# EAGLE schematic kicker-v2.2 (EAGLE 6.4)
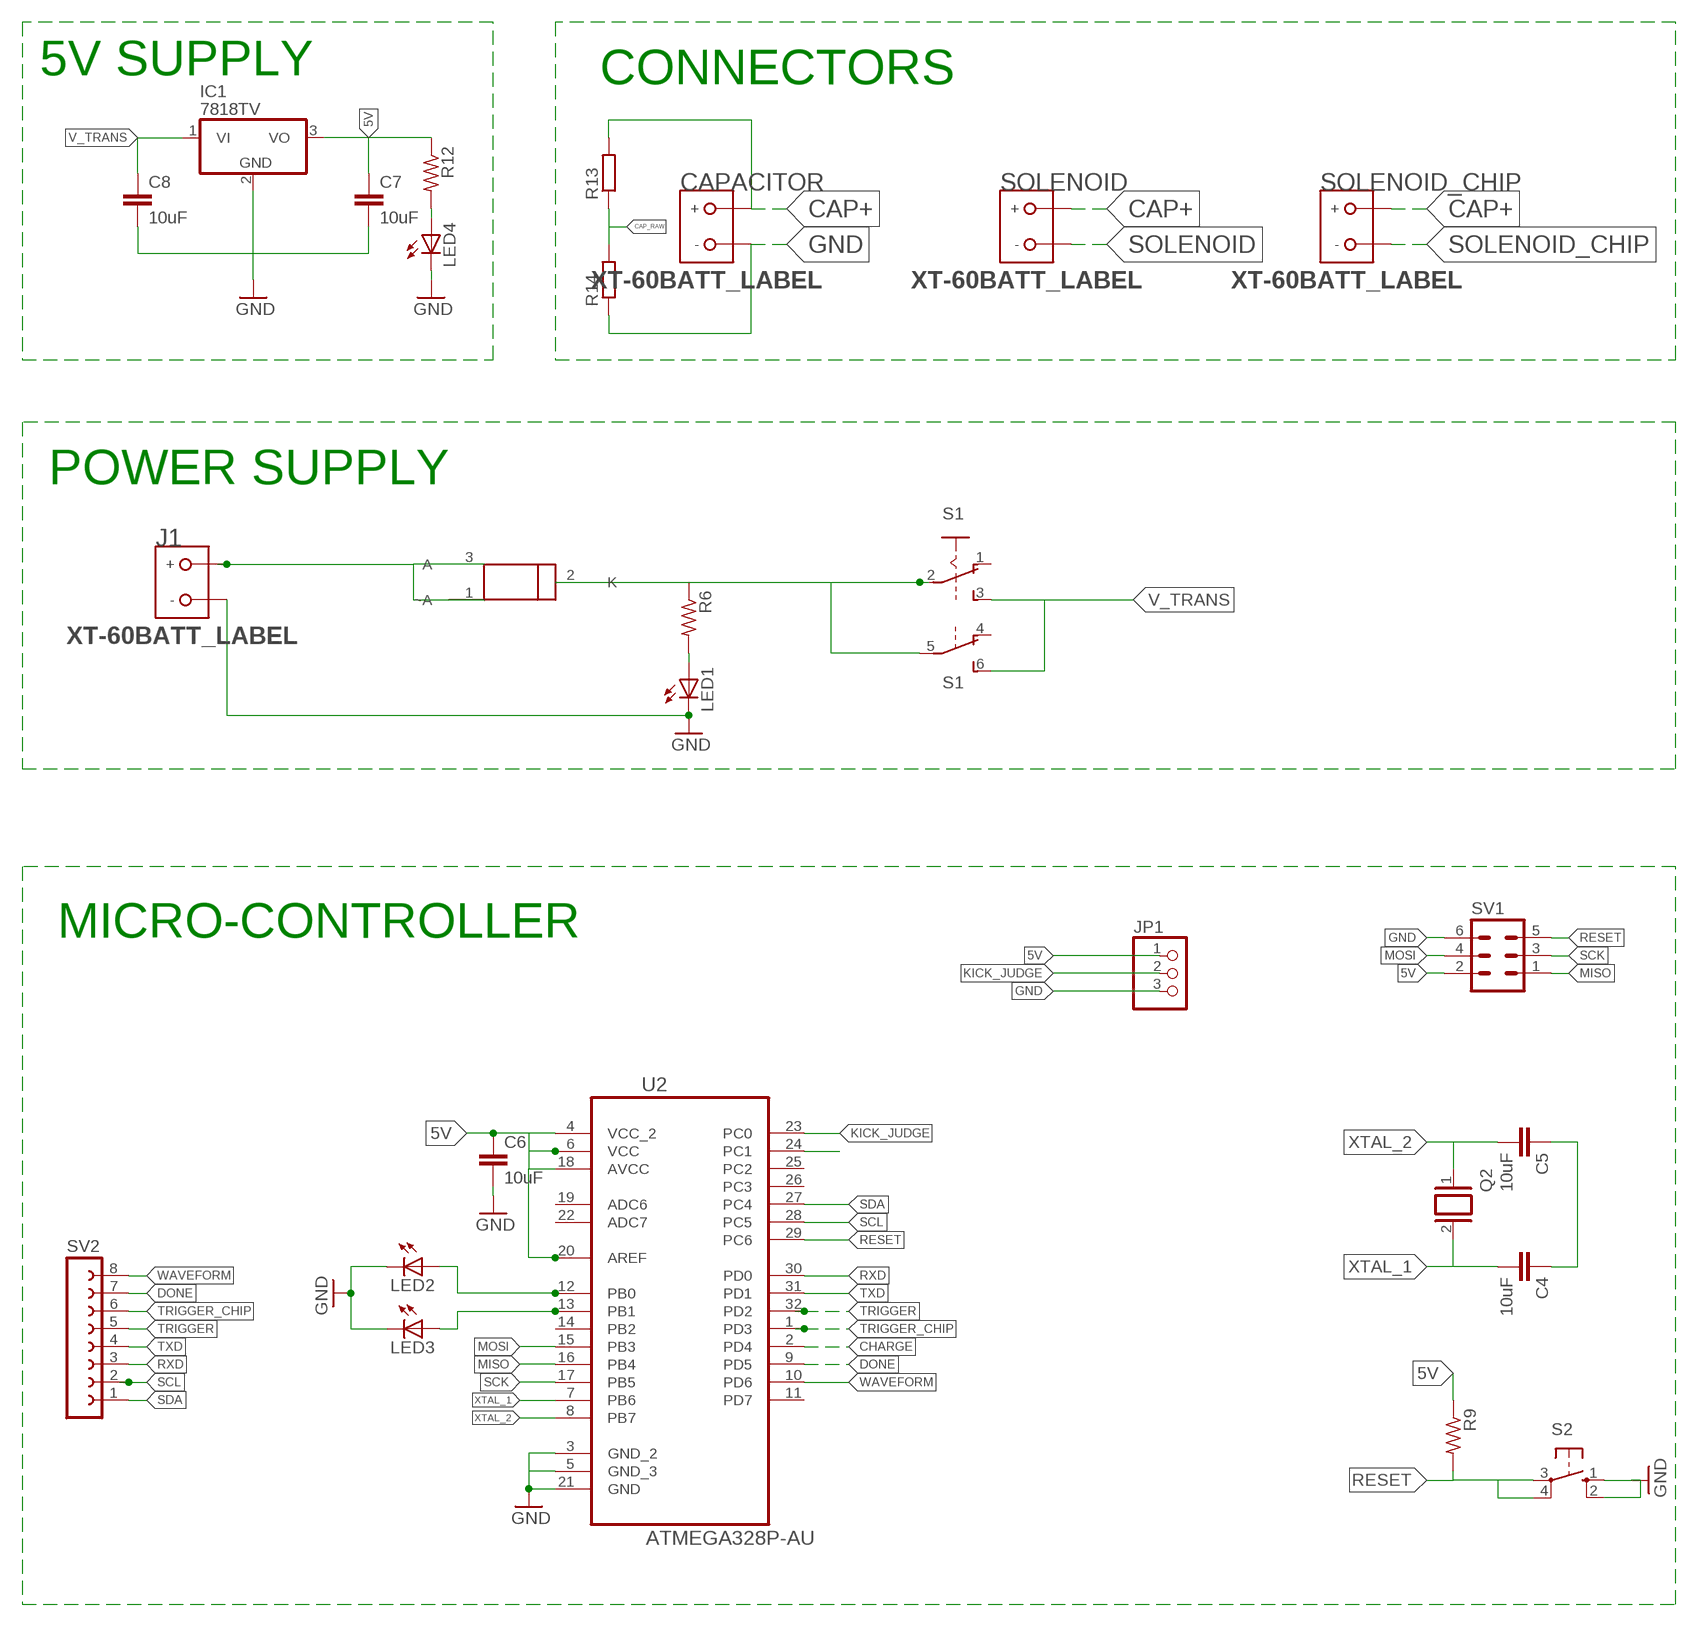
[diagram p0: schematic, sheet 1, part 1 of 2]
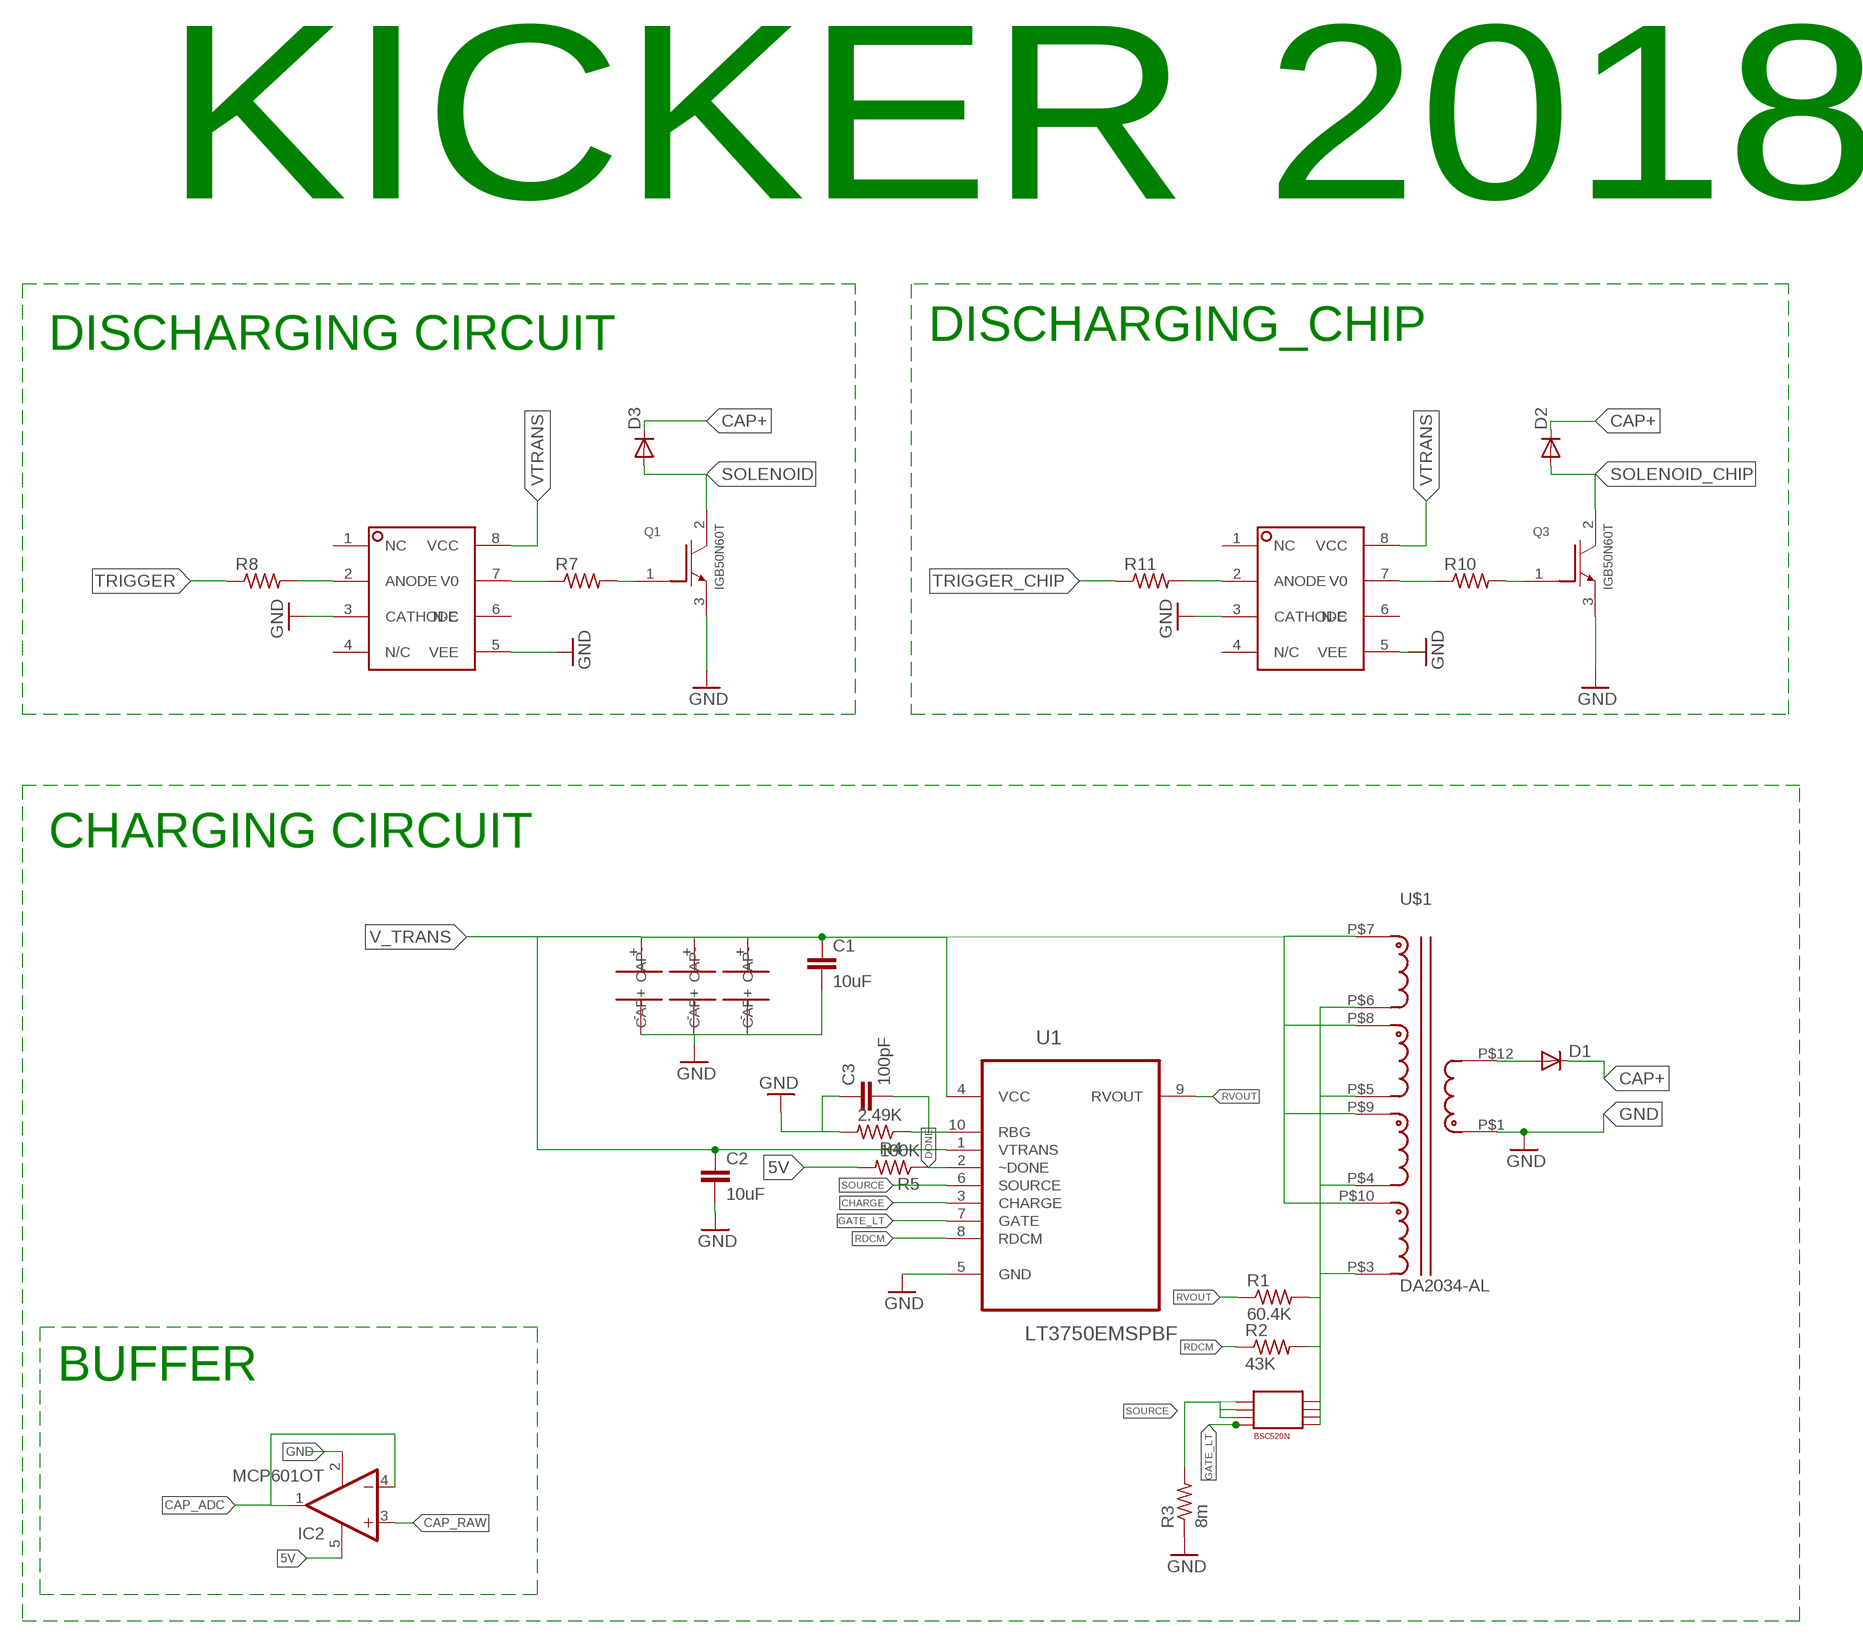
[diagram p1: schematic, sheet 1, part 2 of 2]

## Parts
C1  10uF  C-EUC1206  [C1206]
C2  10uF  C-EUC1206  [C1206]
C3  100pF  C-EUC1206  [C1206]
C4  10uF  C-EUC1206  [C1206]
C5  10uF  C-EUC1206  [C1206]
C6  10uF  C-EUC1206  [C1206]
C7  10uF  C-EUC1206  [C1206]
C8  10uF  C-EUC1206  [C1206]
CAPACITOR  XT-60BATT_LABEL  [XT-60]
D1  DIODE-DO214AA  [DO214AA]
D2  DIODE-DO214AA  [DO214AA]
D3  DIODE-DO214AA  [DO214AA]
IC1  7818TV  [TO220V]
IC2  MCP601OT  [SOT23-5]
J1  XT-60BATT_LABEL  [XT-60]
JP1  PINHD-1X3  [1X03]
LED1  LEDCHIPLED_1206  [CHIPLED_1206]
LED2  LEDCHIPLED_1206  [CHIPLED_1206]
LED3  LEDCHIPLED_1206  [CHIPLED_1206]
LED4  LEDCHIPLED_1206  [CHIPLED_1206]
Q1  IGB50N60T  [TO254P1524X457-3N-2-V]
Q2  XTAL  [Q]
Q3  IGB50N60T  [TO254P1524X457-3N-2-V]
R1  60.4K  R-US_M1206  [M1206]
R2  43K  R-US_M1206  [M1206]
R3  8m  R-US_M1206  [M1206]
R4  2.49K  R-US_M1206  [M1206]
R5  100K  R-US_M1206  [M1206]
R6  R-US_M1206  [M1206]
R7  R-US_M1206  [M1206]
R8  R-US_M1206  [M1206]
R9  R-US_M1206  [M1206]
R10  R-US_M1206  [M1206]
R11  R-US_M1206  [M1206]
R12  R-US_M1206  [M1206]
R13  R-EU_R0805  [R0805]
R14  R-EU_R0805  [R0805]
S1  A68-A31  [A68-A31]
S2  10-XX  [B3F-10XX]
SOLENOID  XT-60BATT_LABEL  [XT-60]
SOLENOID_CHIP  XT-60BATT_LABEL  [XT-60]
SV1  MA03-2  [MA03-2]
SV2  FE08-1  [FE08]
U1  LT3750EMSPBF  [SOP50P490X110-10N]
U2  ATMEGA328P-AU  [QFP80P900X900X120-32N]
U3  LP38690DT-3.3  [TO228P1042X238-3N]
U$1  DA2034-AL  [DA2034-AL]
U$2  56uF  CAP  [SVP_F12]
U$3  56uF  CAP  [SVP_F12]
U$4  56uF  CAP  [SVP_F12]
U$5  BSC520N  [PG-TDSON-8]
U$6  HCPL-3120-300E  [DIL08]
U$7  HCPL-3120-300E  [DIL08]

## Nets
5V: C6.1 C7.1 IC1.3(VO) IC2.5(V+) JP1.1 R5.2 R9.1 R12.1 SV1.2 U2.4(VCC_2) U2.6(VCC) U2.18(AVCC) U2.20(AREF)
CAP+: CAPACITOR.BATT(+) D1.C D2.C D3.C R13.2 SOLENOID.BATT(+) SOLENOID_CHIP.BATT(+)
CAP_ADC: IC2.1(OUT) IC2.4(-IN) U2.24(PC1)
CAP_RAW: IC2.3(+IN) R13.1 R14.2
CHARGE: U1.3(CHARGE) U2.2(PD4)
DONE: R5.1 SV2.7 U1.2(~DONE) U2.9(PD5)
GATE_LT: U1.7(GATE) U$5.G
GND: C1.2 C2.2 C3.1 C6.2 C7.2 C8.2 CAPACITOR.GND(-) IC1.2(GND) IC2.2(V-) J1.GND(-) JP1.3 LED1.C LED2.C LED3.C LED4.C Q1.3(EMITTER) Q3.3(EMITTER) R3.1 R4.2 R14.1 S2.1(S) S2.2(S1) SV1.6 U1.5(GND) U2.3(GND_2) U2.5(GND_3) U2.21(GND) U$1.P$1 U$2.-(CAP-) U$3.-(CAP-) U$4.-(CAP-) U$6.3(CATHODE) U$6.5(VEE) U$7.3(CATHODE) U$7.5(VEE)
KICK_JUDGE: JP1.2 U2.23(PC0)
MISO: SV1.1 U2.16(PB4)
MOSI: SV1.4 U2.15(PB3)
N$1: D1.A U$1.P$12
N$2: R7.1 U$6.7(V0)
N$4: C3.2 R4.1 U1.10(RBG)
N$7: R6.1 S1.2(A:P) S1.5(B:P) U3.2(K)
N$9: Q1.1(GATE) R7.2
N$10: R8.2 U$6.2(ANODE)
N$13: LED1.A R6.2
N$14: R10.1 U$7.7(V0)
N$15: Q3.1(GATE) R10.2
N$16: C4.1 C5.1
N$17: R11.2 U$7.2(ANODE)
N$19: LED2.A U2.12(PB0)
N$20: LED3.A U2.13(PB1)
N$21: LED4.A R12.2
RDCM: R2.1 U1.8(RDCM)
RESET: R9.2 S2.3(P) S2.4(P1) SV1.5 U2.29(PC6)
RVOUT: R1.1 U1.9(RVOUT)
RXD: SV2.3 U2.30(PD0)
SCK: SV1.3 U2.17(PB5)
SCL: SV2.2 U2.28(PC5)
SDA: SV2.1 U2.27(PC4)
SINK: R1.2 R2.2 U$1.P$3 U$1.P$4 U$1.P$5 U$1.P$6 U$5.D1 U$5.D2 U$5.D3 U$5.D4
SOLENOID: D3.A Q1.2(COLLECTOR) SOLENOID.GND(-)
SOLENOID_CHIP: D2.A Q3.2(COLLECTOR) SOLENOID_CHIP.GND(-)
SOURCE: R3.2 U1.6(SOURCE) U$5.S1 U$5.S2 U$5.S3
TRIGGER: R8.1 SV2.5 U2.32(PD2)
TRIGGER_CHIP: R11.1 SV2.6 U2.1(PD3)
TXD: SV2.4 U2.31(PD1)
V_TRANS: C1.1 C2.1 C8.1 IC1.1(VI) S1.3(A:S) S1.6(B:S) U1.1(VTRANS) U1.4(VCC) U$1.P$7 U$1.P$8 U$1.P$9 U$1.P$10 U$2.+(CAP+) U$3.+(CAP+) U$4.+(CAP+)
VIN: J1.BATT(+) U3.1(~A) U3.3(A)
VTRANS: U$6.8(VCC) U$7.8(VCC)
WAVEFORM: SV2.8 U2.10(PD6)
XTAL_1: C4.2 Q2.2 U2.7(PB6)
XTAL_2: C5.2 Q2.1 U2.8(PB7)
Unconnected: S1.1(A:O) S1.4(B:O) U2.11(PD7) U2.14(PB2) U2.19(ADC6) U2.22(ADC7) U2.25(PC2) U2.26(PC3) U$6.1(NC) U$6.4(N/C) U$6.6(N-C) U$7.1(NC) U$7.4(N/C) U$7.6(N-C)

## Notes on the sheet
- 5V SUPPLY | CONNECTORS
- KICKER 2018
- DISCHARGING CIRCUIT | DISCHARGING_CHIP
- POWER SUPPLY
- CHARGING CIRCUIT
- MICRO-CONTROLLER
- BUFFER

## Library data of the parts
C1-C8 = resistor:C-EU: CAPACITOR, European symbol
CAPACITOR J1 SOLENOID SOLENOID_CHIP = XT-60:XT-60: XT-60 Power Connector Distributor: HobbyKing <http://www.hobbyking.com/hobbyking/store/RC_PRODUCT_SEARCH.asp?strSearch=xt-60>
D1-D3 = diode:DIODE-: DIODE
IC1 = linear:78*: Positive VOLTAGE REGULATOR Source: http://cache.national.com/ds/LM/LM78L05.pdf http://www.fairchildsemi.com/ds/LM/LM7805.pdf
IC2 = linear:MCP601: Single Op Amp 2.7V to 6.0V Single Supply CMOS Source: http://ww1.microchip.com/downloads/en/DeviceDoc/21314g.pdf
JP1 = pinhead:PINHD-1X3: PIN HEADER
LED1-LED4 = led:LED: LED OSRAM: - CHIPLED LG R971, LG N971, LY N971, LG Q971, LY Q971, LO R971, LY R971 LH N974, LH R974 LS Q976, LO Q976, LY Q976 LO Q996 - Hyper CHIPLED LW Q18S LB Q993, LB Q99A, LB R99A - SideLED LS A670, LO A670, LY A670, LG A670, LP A670 LB A673, LV A673, LT A673, LW A673 LH A674 LY A675 LS A676, LA A676, LO A676, LY A676, LW A676 LS A679, LY A679, LG A679 - Hyper Micro SIDELED® LS Y876, LA Y876, LO Y876, LY Y876 LT Y87S - SmartLED LW L88C, LW L88S LB L89C, LB L89S, LG L890 LS L89K, LO L89K, LY L89K LS L896, LA L896, LO L896, LY L896 - TOPLED LS T670, LO T670, LY T670, LG T670, LP T670 LSG T670, LSP T670, LSY T670, LOP T670, LYG T670 LG T671, LOG T671, LSG T671 LB T673, LV T673, LT T673, LW T673 LH T674 LS T676, LA T676, LO T676, LY T676, LB T676, LH T676, LSB T676, LW T676 LB T67C, LV T67C, LT T67C, LS T67K, LO T67K, LY T67K, LW E67C LS E67B, LA E67B, LO E67B, LY E67B, LB E67C, LV E67C, LT E67C LW T67C LS T679, LY T679, LG T679 LS T770, LO T770, LY T770, LG T770, LP T770 LB T773, LV T773, LT T773, LW T773 LH T774 LS E675, LA E675, LY E675, LS T675 LS T776, LA T776, LO T776, LY T776, LB T776 LHGB T686 LT T68C, LB T68C - Hyper Mini TOPLED® LB M676 - Mini TOPLED Santana® LG M470 LS M47K, LO M47K, LY M47K Source: http://www.osram.convergy.de LUXEON: - LUMILED® LXK2-PW12-R00, LXK2-PW12-S00, LXK2-PW14-U00, LXK2-PW14-V00 LXK2-PM12-R00, LXK2-PM12-S00, LXK2-PM14-U00 LXK2-PE12-Q00, LXK2-PE12-R00, LXK2-PE12-S00, LXK2-PE14-T00, LXK2-PE14-U00 LXK2-PB12-K00, LXK2-PB12-L00, LXK2-PB12-M00, LXK2-PB14-N00, LXK2-PB14-P00, LXK2-PB14-Q00 LXK2-PR12-L00, LXK2-PR12-M00, LXK2-PR14-Q00, LXK2-PR14-R00 LXK2-PD12-Q00, LXK2-PD12-R00, LXK2-PD12-S00 LXK2-PH12-R00, LXK2-PH12-S00 LXK2-PL12-P00, LXK2-PL12-Q00, LXK2-PL12-R00 Source: www.luxeon.com KINGBRIGHT: KA-3528ASYC Source: www.kingbright.com
Q1 Q3 = IGB50N60T:IGB50N60T: IGB50N60T Low Loss IGBT: IGBT in TRENCHSTOP and Fieldstop technology, IC 50A TO254P1524X457-3N-2-V
Q2 = special:XTAL: CRYSTAL
R1-R12 = resistor:R-US_: RESISTOR, American symbol
R13 R14 = resistor:R-EU_: RESISTOR, European symbol
S1 = switch:A68-A31: SLIDING SWITCH Siemens, distributor Buerklin, 11G766
S2 = switch-omron:10-XX: OMRON SWITCH; MPN: B3F-1000; OC_FARNELL: 176432; OC_NEWARK: 36M3542
SV1 = con-lstb:MA03-2: PIN HEADER; OC_FARNELL: unknown; OC_NEWARK: unknown
SV2 = con-lsta:FE08-1: FEMALE HEADER; OC_FARNELL: unknown; OC_NEWARK: unknown
U1 = LT3750-element:LT3750EMSPBF: Capacitor Charger Controller; MPN: LT3750EMS#PBF; OC_FARNELL: 1273500; OC_NEWARK: 57M8591; PACKAGE: MSOP-10; SUPPLIER: Linear Technology
U2 = Atmel_By_element14_Batch_1-00:ATMEGA328P-AU: 8-bit Microcontroller with In-System Programmable Flash; MPN: ATMEGA328P-AU; OC_FARNELL: 1715486; OC_NEWARK: 14R4631; PACKAGE: TQFP-32; SUPPLIER: Atmel
U3 = LP38690DT-3.3:LP38690DT-3.3; MPN: LP38690DT-3.3; OC_FARNELL: 1008048; OC_NEWARK: 41K7439; PACKAGE: TO-252; SUPPLIER: National Semiconductor
U$1 = inductor-coilcraft-2:DA2034-AL: Flyback Transformer for Linear Technology LT3750 Reference: http://www.coilcraft.com/da2032.cfm L - 10 uH TurnsRatio Pri:Sec - 1:10 Ipeak - 10.0 A Interwinding capacitance - 128 pF DCRmax: Pri - 0.018, Sec - 1.75 Ohms
U$2-U$4 = SVP_F12:CAP
U$5 = BSC520N:BSC520N
U$6 U$7 = adafruit:HCPL-3120-300E